# EAGLE design LeftHandPath_Controls (EAGLE 9.6.2)
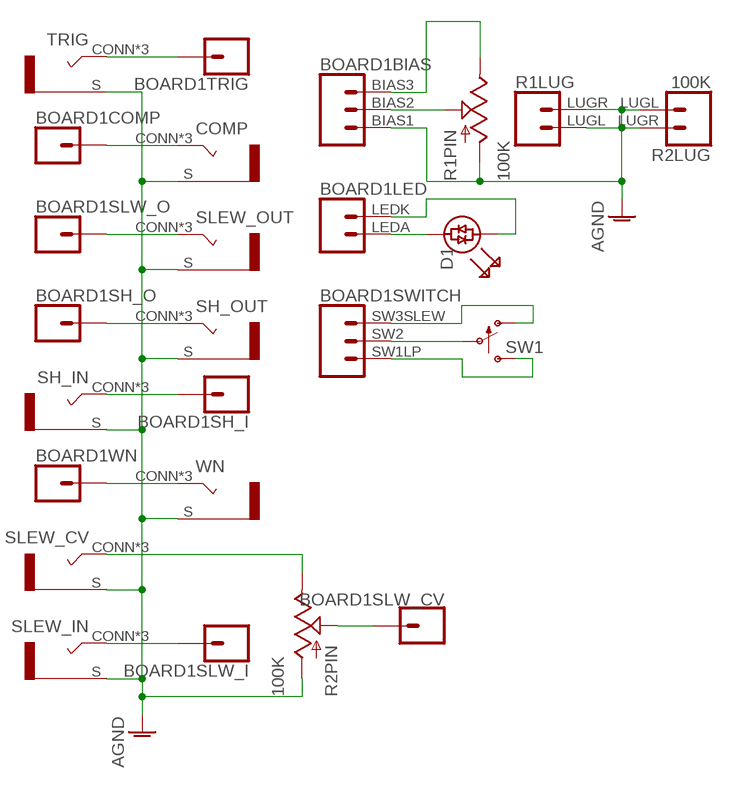
[diagram p0: schematic, sheet 1]

## Parts
BOARD1  TLHPFOC_LINK  [TLHPFOC]
COMP  COMBI-JACKCINCHNANA  [NEWCOMBOJACK_PANEL]
D1  5MM_BICOLOUR_LED  [LED5MM]
R1  100K  POTENTIOMETER  [ALPHA_RV09_9MMPOT]
R2  100K  POTENTIOMETER  [ALPHA_RV09_9MMPOT]
SH_IN  COMBI-JACKCINCHNANA  [NEWCOMBOJACK_PANEL]
SH_OUT  COMBI-JACKCINCHNANA  [NEWCOMBOJACK_PANEL]
SLEW_CV  COMBI-JACKCINCHNANA  [NEWCOMBOJACK_PANEL]
SLEW_IN  COMBI-JACKCINCHNANA  [NEWCOMBOJACK_PANEL]
SLEW_OUT  COMBI-JACKCINCHNANA  [NEWCOMBOJACK_PANEL]
SW1  SPDT_SWITCHDW1  [MICRODPDT-DW1]
TRIG  COMBI-JACKCINCHNANA  [NEWCOMBOJACK_PANEL]
WN  COMBI-JACKCINCHNANA  [NEWCOMBOJACK_PANEL]

## Nets
AGND: BOARD1.BIAS1 COMP.S R1.C1(PIN:A) R1.LUGL R1.LUGR R2.C1(PIN:A) R2.LUGL R2.LUGR SH_IN.S SH_OUT.S SLEW_CV.S SLEW_IN.S SLEW_OUT.S TRIG.S WN.S
N$1: BOARD1.TRIG TRIG.CONN(T) TRIG.T1(T) TRIG.T2(T)
N$2: BOARD1.COMP COMP.CONN(T) COMP.T1(T) COMP.T2(T)
N$3: BOARD1.SLW_O SLEW_OUT.CONN(T) SLEW_OUT.T1(T) SLEW_OUT.T2(T)
N$4: BOARD1.SH_O SH_OUT.CONN(T) SH_OUT.T1(T) SH_OUT.T2(T)
N$5: BOARD1.SH_I SH_IN.CONN(T) SH_IN.T1(T) SH_IN.T2(T)
N$6: BOARD1.WN WN.CONN(T) WN.T1(T) WN.T2(T)
N$7: BOARD1.BIAS2 R1.C2(PIN:W)
N$8: BOARD1.LEDA D1.A(AN)
N$9: BOARD1.LEDK D1.K(KA)
N$10: BOARD1.SLW_I SLEW_IN.CONN(T) SLEW_IN.T1(T) SLEW_IN.T2(T)
N$11: R2.C3(PIN:B) SLEW_CV.CONN(T) SLEW_CV.T1(T) SLEW_CV.T2(T)
N$12: BOARD1.BIAS3 R1.C3(PIN:B)
N$13: BOARD1.SW2 SW1.C2(P)
N$14: BOARD1.SW3SLEW SW1.C1(O)
N$15: BOARD1.SW1LP SW1.C3(S)
N$16: BOARD1.SLW_CV R2.C2(PIN:W)

## Library data of the parts
BOARD1 = ElectricNoodleBox:TLHPFOC_LINK
COMP SH_IN SH_OUT SLEW_CV SLEW_IN SLEW_OUT TRIG WN = ElectricNoodleBox:COMBI-JACK
D1 = ElectricNoodleBox:5MM_BICOLOUR_LED
R1 R2 = ElectricNoodleBox:POTENTIOMETER
SW1 = ElectricNoodleBox:SPDT_SWITCH

## Board
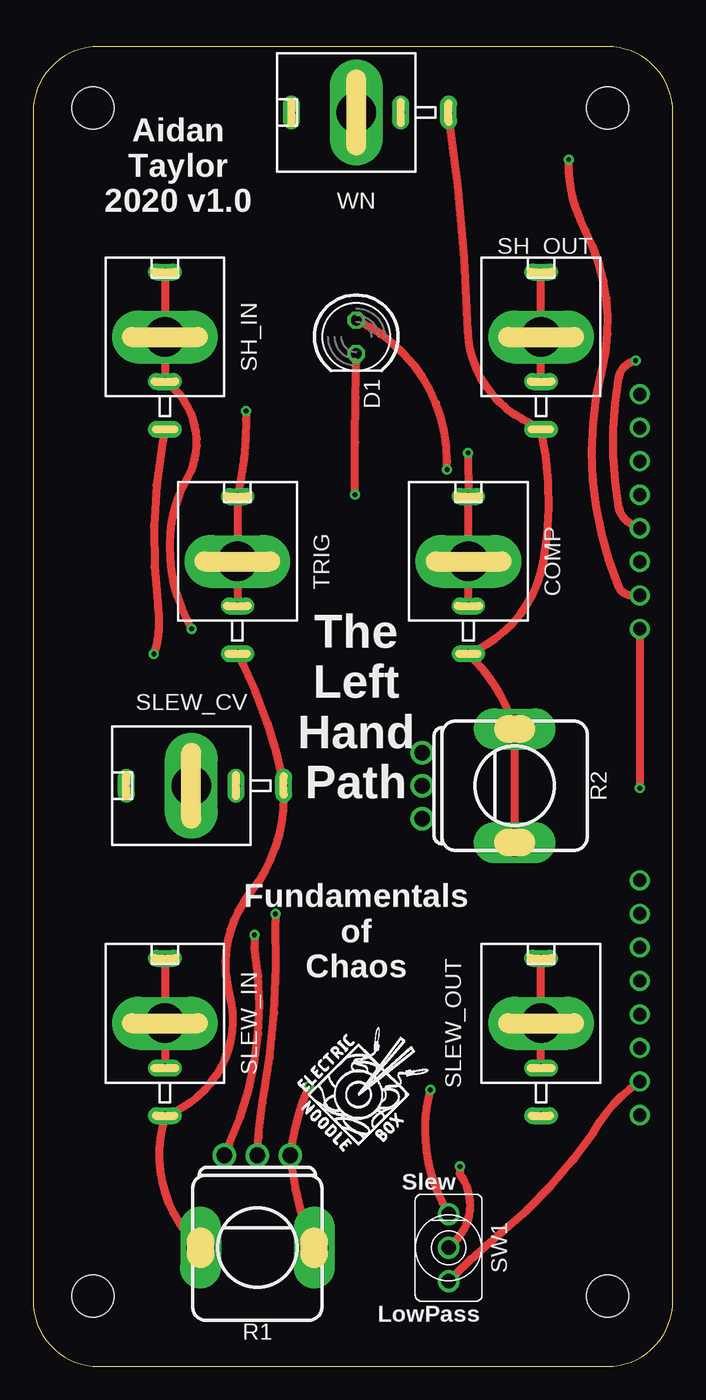
[diagram p1: board, top side]
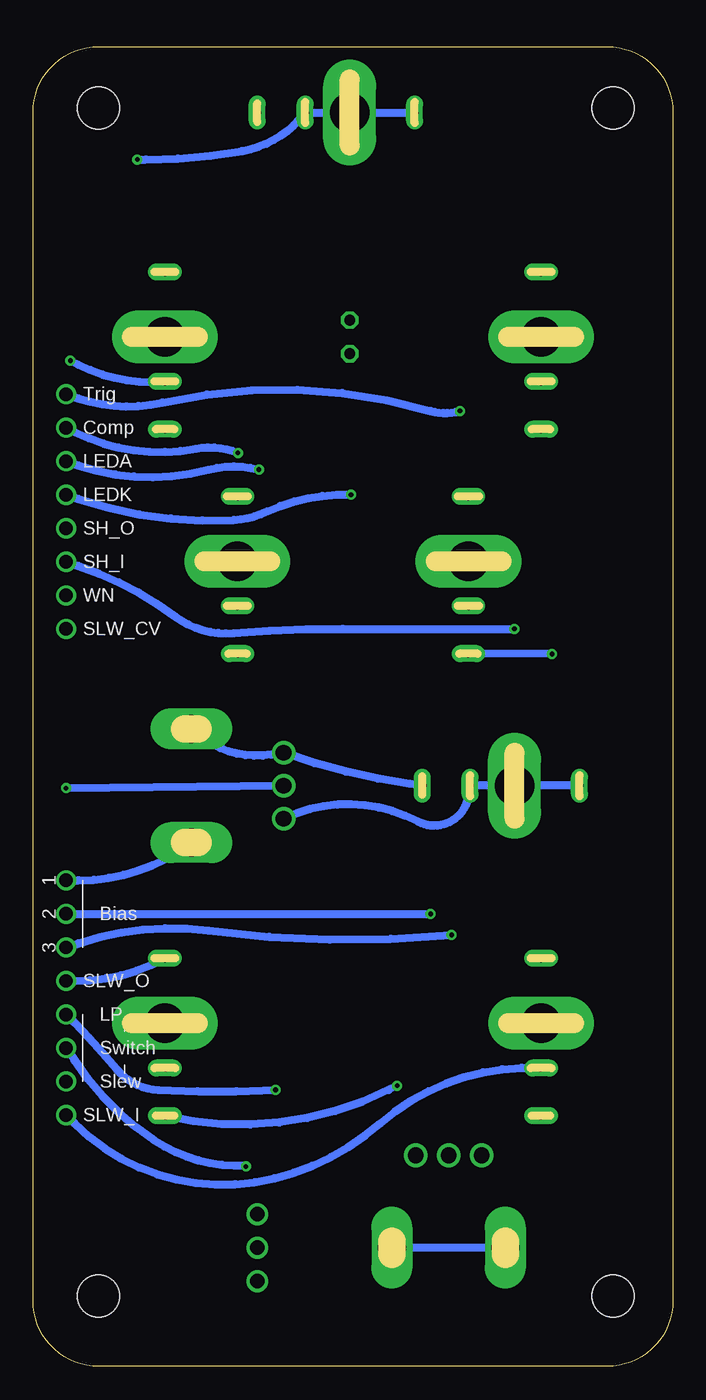
[diagram p2: board, bottom side, seen from below]

Size 48.5 x 100 mm. Coordinates in mm from the lower left corner, seen from the top.
Outline: 0,95 0,5 arc90 5,0 43.5,0 arc90 48.5,5 48.5,95 arc90 43.5,100 5,100 arc90 0,95
Copper layers (1*16): Top 0.035mm / dielectric 1.5mm / Bottom 0.035mm
Design rules "default": minimum track width 6mil, minimum drill 0.35mm, track to track 6mil, track to pad 6mil, pad to pad 6mil, via to via 6mil, smd to smd 6mil, copper to edge 40mil, drill to drill 6mil, minimum pad ring 10mil, minimum via ring 8mil, stop-mask expansion 4mil, vias tented up to drill 0mil, thermal gap 10mil

### Footprints (pad centres in the part's own frame; a part is rotated, then mirrored left to right if it is on the bottom)
TLHPFOC = drill 1.016: BIAS1 63.5,2.54; BIAS2 66.04,2.54; BIAS3 68.58,2.54; COMP 29.21,2.54; LEDA 31.75,2.54; LEDK 34.29,2.54; SH_I 39.37,2.54; SH_O 36.83,2.54; SLW_CV 44.45,2.54; SLW_I 81.28,2.54; SLW_O 71.12,2.54; SW1LP 73.66,2.54; SW2 76.2,2.54; SW3SLEW 78.74,2.54; TRIG 26.67,2.54; WN 41.91,2.54 | hole 3.2: 5,5; 95,5; 95,44; 5,44
NEWCOMBOJACK_PANEL = drill 3 pad 3.6 long: CONN 0,0 | drill 0.6 pad 1.27 long: S 0,-7; T1 0,4.92; T2 0,-3.38
LED5MM = drill 0.813 octagon: A -1.27,0; K 1.27,0
ALPHA_RV09_9MMPOT = drill 1.2 pad 1.778: C1 -2.5,-7; C2 0,-7; C3 2.5,-7 | drill 2.1 pad 2.8 long: LUGL -4.3,0; LUGR 4.3,0
MICRODPDT-DW1 = drill 1.1: C1 0,-2.54; C2 0,0; C3 0,2.54

### Placement (x,y rotation side)
BOARD1  48.53,100.33 270 bottom
COMP  33,61 0 top
D1  24.5,78 270 top
R1  17,9 180 top
R2  36.5,44 270 top
SH_IN  10,78 0 top
SH_OUT  38.5,78 0 top
SLEW_CV  12,44 90 top
SLEW_IN  10,26 0 top
SLEW_OUT  38.5,26 0 top
SW1  31.5,9 0 top
TRIG  15.5,61 0 top
U$1  [LOGO10X10]  20,16 0 top
WN  24.5,95 90 top

### Tracks (layer width: path | path; a pad name or v marks a point on that pad's centre or on a via)
AGND  (via drill 0.35)
  Top 0.61: WN.S arc-6 32.97,78.42 arc60 37.1,71.75 SH_OUT.S arc-23 38.69,60.96 arc-54 33.61,54.29 COMP.S 33.61,53.34 arc-26 R2.LUGL R2.LUGR | SH_IN.S 9.79,69.85 arc17 9.48,57.47 arc-25 v9.16,53.98 | TRIG.S 15.83,53.34 arc-15 SLEW_CV.S 19,43.18 arc-39 16.46,35.88 arc54 14.88,28.26 arc-86 SLEW_IN.S 9.79,18.1 arc61 R1.LUGR | v20.91,21.27 arc13 19.64,16.83 R1.C1 19.64,14.92 arc17 R1.LUGL
  Bottom 0.61: BOARD1.BIAS1 45.04,36.83 arc-37 R2.LUGR | v9.16,53.98 TRIG.S | R1.LUGR R1.LUGL | v20.91,21.27 21.54,20.95 arc40 SLEW_OUT.S | SLEW_CV.S 19.95,44.13 arc12 R2.C1 30.43,46.35 arc53 R2.LUGL
N$1  (via drill 0.35)
  Top 0.61: v16.14,72.39 16.14,71.75 arc-13 TRIG.T1 TRIG.CONN TRIG.T2
  Bottom 0.61: BOARD1.TRIG 45.04,73.34 arc-31 38.69,73.03 arc29 18.37,72.39 arc-33 v16.14,72.39
N$2  (via drill 0.35)
  Top 0.61: v32.97,69.22 COMP.T1 COMP.CONN COMP.T2
  Bottom 0.61: BOARD1.COMP 45.35,70.8 arc-37 36.15,69.53 arc33 v32.97,69.22
N$3
  Top 0.61: SLEW_OUT.T2 SLEW_OUT.CONN SLEW_OUT.T1
  Bottom 0.61: BOARD1.SLW_O 45.35,29.21 arc-28 SLEW_OUT.T1
N$4  (via drill 0.35)
  Top 0.61: BOARD1.SH_O 45.35,63.82 arc-53 44.4,65.09 arc-21 44.4,74.93 arc-69 v45.67,76.2 | SH_OUT.T2 SH_OUT.CONN SH_OUT.T1
  Bottom 0.61: v45.67,76.2 45.04,75.88 arc-31 SH_OUT.T2
N$5  (via drill 0.35)
  Top 0.61: v12.02,55.88 11.7,56.52 arc-32 10.43,63.18 arc-24 11.7,67.31 arc85 SH_IN.T2 SH_IN.CONN SH_IN.T1
  Bottom 0.61: BOARD1.SH_I 45.04,60.64 arc18 37.73,56.83 arc-41 33.29,55.56 arc5 25.04,55.88 arc-1 v12.02,55.88
N$6  (via drill 0.35)
  Top 0.61: BOARD1.WN 45.35,58.42 arc-67 44.4,59.05 arc-36 43.13,75.56 arc41 41.86,86.04 arc-29 v40.59,91.44
  Bottom 0.61: v40.59,91.44 39.96,91.44 arc-10 32.66,92.08 arc-43 WN.T2 WN.CONN WN.T1
N$7  (via drill 0.35)
  Top 0.61: v18.37,34.29 18.37,33.66 arc-13 17.41,20 arc7 17.1,17.46 R1.C2
  Bottom 0.61: BOARD1.BIAS2 v18.37,34.29
N$8  (via drill 0.35)
  Top 0.61: v31.38,67.94 31.38,68.58 arc66 D1.A
  Bottom 0.61: BOARD1.LEDA 45.04,68.26 arc-33 35.2,67.94 arc29 v31.38,67.94
N$9  (via drill 0.35)
  Top 0.61: v24.4,66.04 24.4,66.67 arc-1 D1.K
  Bottom 0.61: BOARD1.LEDK 45.04,65.72 arc-21 33.29,64.14 arc-22 30.75,64.77 arc27 v24.4,66.04
N$10
  Top 0.61: SLEW_IN.T1 SLEW_IN.CONN SLEW_IN.T2
  Bottom 0.61: BOARD1.SLW_I 45.35,18.41 arc-54 31.7,13.97 arc-32 22.18,18.41 arc44 SLEW_IN.T2
N$11
  Bottom 0.61: SLEW_CV.T1 SLEW_CV.CONN SLEW_CV.T2 15.51,43.18 arc109 19.32,41.27 arc-53 R2.C3
N$12  (via drill 0.35)
  Top 0.61: v16.78,32.7 16.78,31.75 arc-34 14.88,16.83 R1.C3
  Bottom 0.61: BOARD1.BIAS3 45.04,32.07 arc26 35.2,33.02 arc-13 v16.78,32.7 arc193 v16.78,32.7
N$13  (via drill 0.35)
  Top 0.61: v32.36,15.16 32.34,14.61 arc-82 32.02,9.53 SW1.C2
  Bottom 0.61: BOARD1.SW2 45.35,23.18 arc-23 39.32,17.14 arc-37 32.34,15.24 arc217 v32.36,15.16
N$14
  Top 0.61: BOARD1.SW3SLEW arc26 42.5,17.78 arc-16 35.51,10.16 arc6 32.02,6.99 SW1.C1
N$15  (via drill 0.35)
  Top 0.61: SW1.C3 31.07,12.38 arc-42 v30.11,20.95
  Bottom 0.61: BOARD1.SW1LP 45.35,26.04 arc5 42.18,22.54 arc-48 39.01,20.95 arc-5 v30.11,20.95
N$16  (via drill 0.35)
  Top 0.61: BOARD1.SLW_CV v45.99,43.81
  Bottom 0.61: v45.99,43.81 R2.C2

### Text on the board
tPlace: Aidan / Taylor / 2020 v1.0 | The / Left / Hand / Path | Fundamentals / of / Chaos | Slew | LowPass